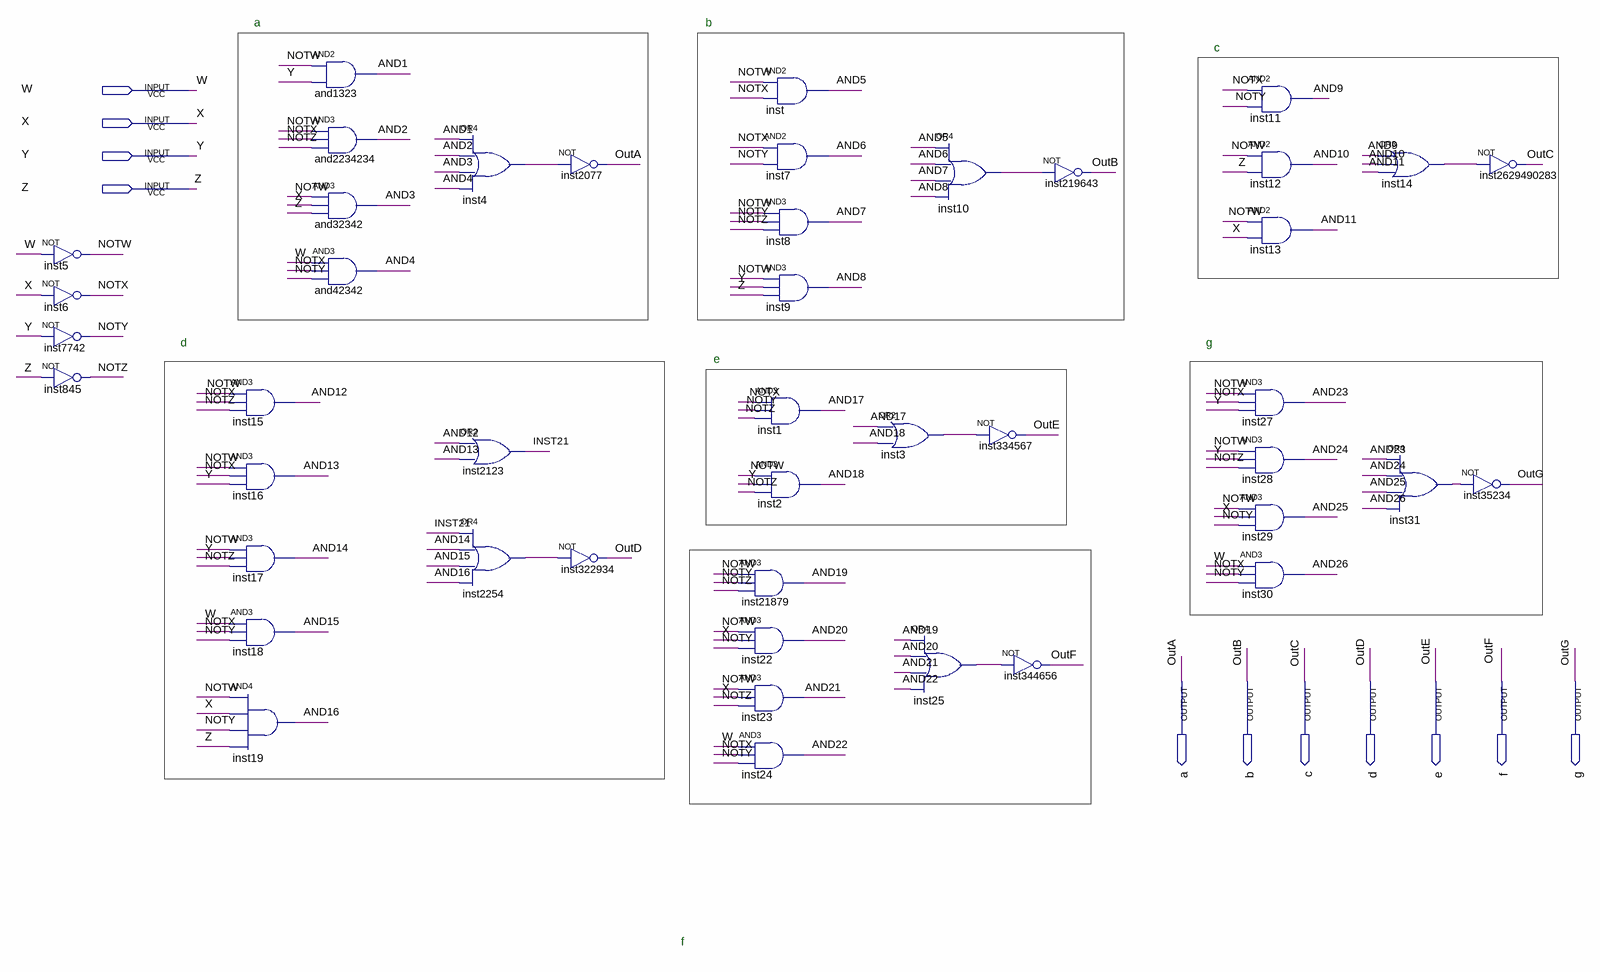
[diagram p0: schematic sheet]
// Quartus schematic display7seg2.bdf as structural Verilog: 45 symbols, 11 pins
module display7seg2 (
  input  W,
  input  X,
  input  Y,
  input  Z,
  output a,
  output b,
  output c,
  output d,
  output e,
  output f,
  output g
);

  wire AND1, AND2, AND3, AND4, AND5, AND6, AND7, AND8, AND9, AND10, AND11, AND12, AND13, AND14, AND15, AND16,
       AND17, AND18, AND19, AND20, AND21, AND22, AND23, AND24, AND25, AND26, inst3_out, inst4_out,
       inst10_out, inst14_out, INST21, inst25_out, inst31_out, inst2254_out, NOTW, NOTX, NOTY, NOTZ;

  not inst5 (NOTW, W);
  not inst6 (NOTX, X);
  not inst7742 (NOTY, Y);
  not inst845 (NOTZ, Z);
  and inst15 (AND12, NOTW, NOTX, NOTZ);
  and inst16 (AND13, NOTW, NOTX, Y);
  and inst17 (AND14, NOTW, Y, NOTZ);
  and inst18 (AND15, W, NOTX, NOTY);
  and inst19 (AND16, NOTW, X, NOTY, Z);
  and and1323 (AND1, NOTW, Y);
  and and2234234 (AND2, NOTW, NOTX, NOTZ);
  and and32342 (AND3, NOTW, X, Z);
  and and42342 (AND4, W, NOTX, NOTY);
  or inst4 (inst4_out, AND1, AND2, AND3, AND4);
  or inst2123 (INST21, AND12, AND13);
  or inst2254 (inst2254_out, INST21, AND14, AND15, AND16);
  not inst2077 (a, inst4_out);
  not inst322934 (d, inst2254_out);
  and inst21879 (AND19, NOTW, NOTY, NOTZ);
  and inst22 (AND20, NOTW, X, NOTY);
  and inst23 (AND21, NOTW, X, NOTZ);
  and inst24 (AND22, W, NOTX, NOTY);
  and inst (AND5, NOTW, NOTX);
  and inst7 (AND6, NOTX, NOTY);
  and inst8 (AND7, NOTW, NOTY, NOTZ);
  and inst9 (AND8, NOTW, Y, Z);
  and inst1 (AND17, NOTX, NOTY, NOTZ);
  and inst2 (AND18, NOTW, Y, NOTZ);
  or inst10 (inst10_out, AND5, AND6, AND7, AND8);
  or inst3 (inst3_out, AND17, AND18);
  or inst25 (inst25_out, AND19, AND20, AND21, AND22);
  not inst334567 (e, inst3_out);
  not inst344656 (f, inst25_out);
  not inst219643 (b, inst10_out);
  and inst11 (AND9, NOTX, NOTY);
  and inst12 (AND10, NOTW, Z);
  and inst13 (AND11, NOTW, X);
  and inst27 (AND23, NOTW, NOTX, Y);
  and inst28 (AND24, NOTW, Y, NOTZ);
  and inst29 (AND25, NOTW, X, NOTY);
  and inst30 (AND26, W, NOTX, NOTY);
  or inst14 (inst14_out, AND9, AND10, AND11);
  or inst31 (inst31_out, AND23, AND24, AND25, AND26);
  not inst35234 (g, inst31_out);
  not inst2629490283 (c, inst14_out);

  // Other names for the same wires on the sheet: OutA = a; OutB = b; OutC = c; OutD = d; OutE = e; OutF = f; OutG = g

  // Notes on the sheet:
  //   a
  //   b
  //   c
  //   d
  //   g
  //   e
  //   f
endmodule
